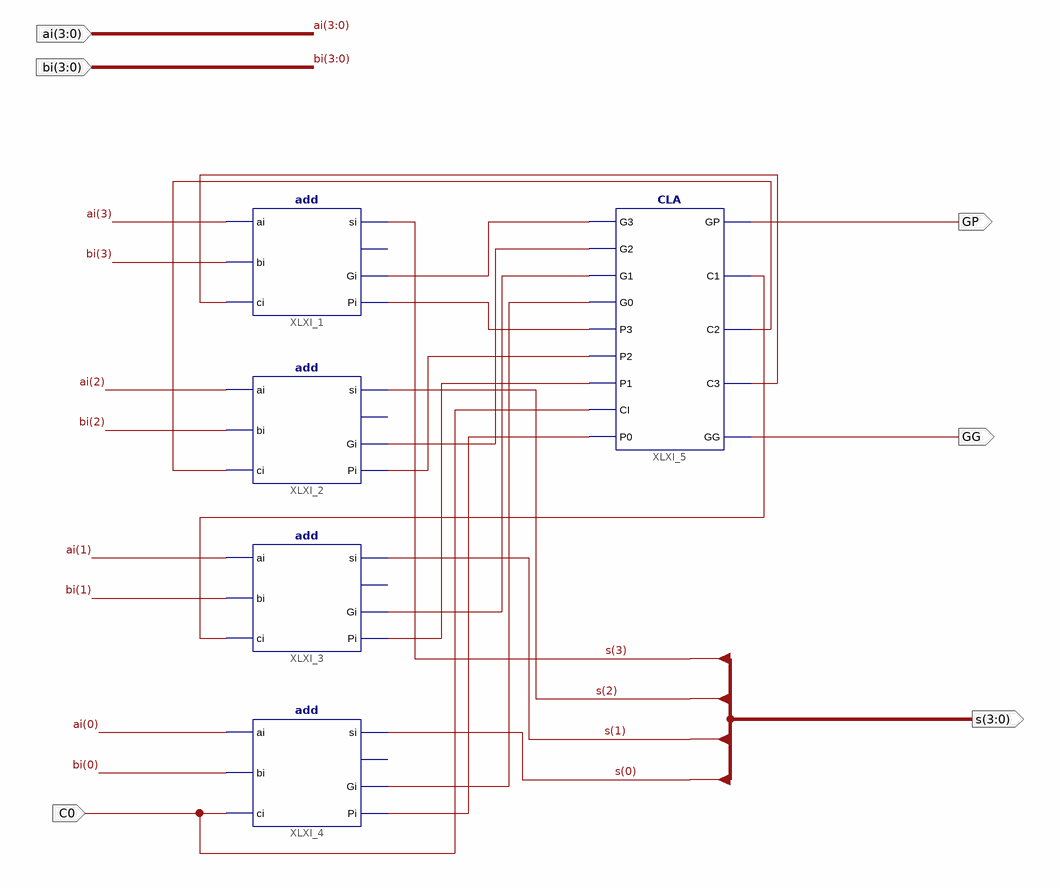
[diagram p0: schematic sheet 1]
// Xilinx ISE schematic add4b.sch (kintex7) as structural Verilog: 5 symbols, 6 ports
module add4b (
  input  [3:0] ai,
  input  [3:0] bi,
  input  C0,
  output GP,
  output GG,
  output [3:0] s
);

  wire XLXN_9, XLXN_10, XLXN_11, XLXN_20, XLXN_21, XLXN_22, XLXN_23, XLXN_24, XLXN_25, XLXN_26, XLXN_27;

  add XLXI_1 (.ai(ai[3]), .bi(bi[3]), .ci(XLXN_9), .si(s[3]), .Gi(XLXN_20), .Pi(XLXN_24));  // open: co
  add XLXI_2 (.ai(ai[2]), .bi(bi[2]), .ci(XLXN_10), .si(s[2]), .Gi(XLXN_21), .Pi(XLXN_25));  // open: co
  add XLXI_3 (.ai(ai[1]), .bi(bi[1]), .ci(XLXN_11), .si(s[1]), .Gi(XLXN_22), .Pi(XLXN_26));  // open: co
  add XLXI_4 (.ai(ai[0]), .bi(bi[0]), .ci(C0), .si(s[0]), .Gi(XLXN_23), .Pi(XLXN_27));  // open: co
  CLA XLXI_5 (
    .G3(XLXN_20), .G2(XLXN_21), .G1(XLXN_22), .G0(XLXN_23), .P3(XLXN_24), .P2(XLXN_25), .P1(XLXN_26),
    .CI(C0), .P0(XLXN_27), .GP(GP), .C1(XLXN_11), .C2(XLXN_10), .C3(XLXN_9), .GG(GG));
endmodule
